# Altium schematic sheet Face_MainBack1V0.SchDoc
size OrCAD D
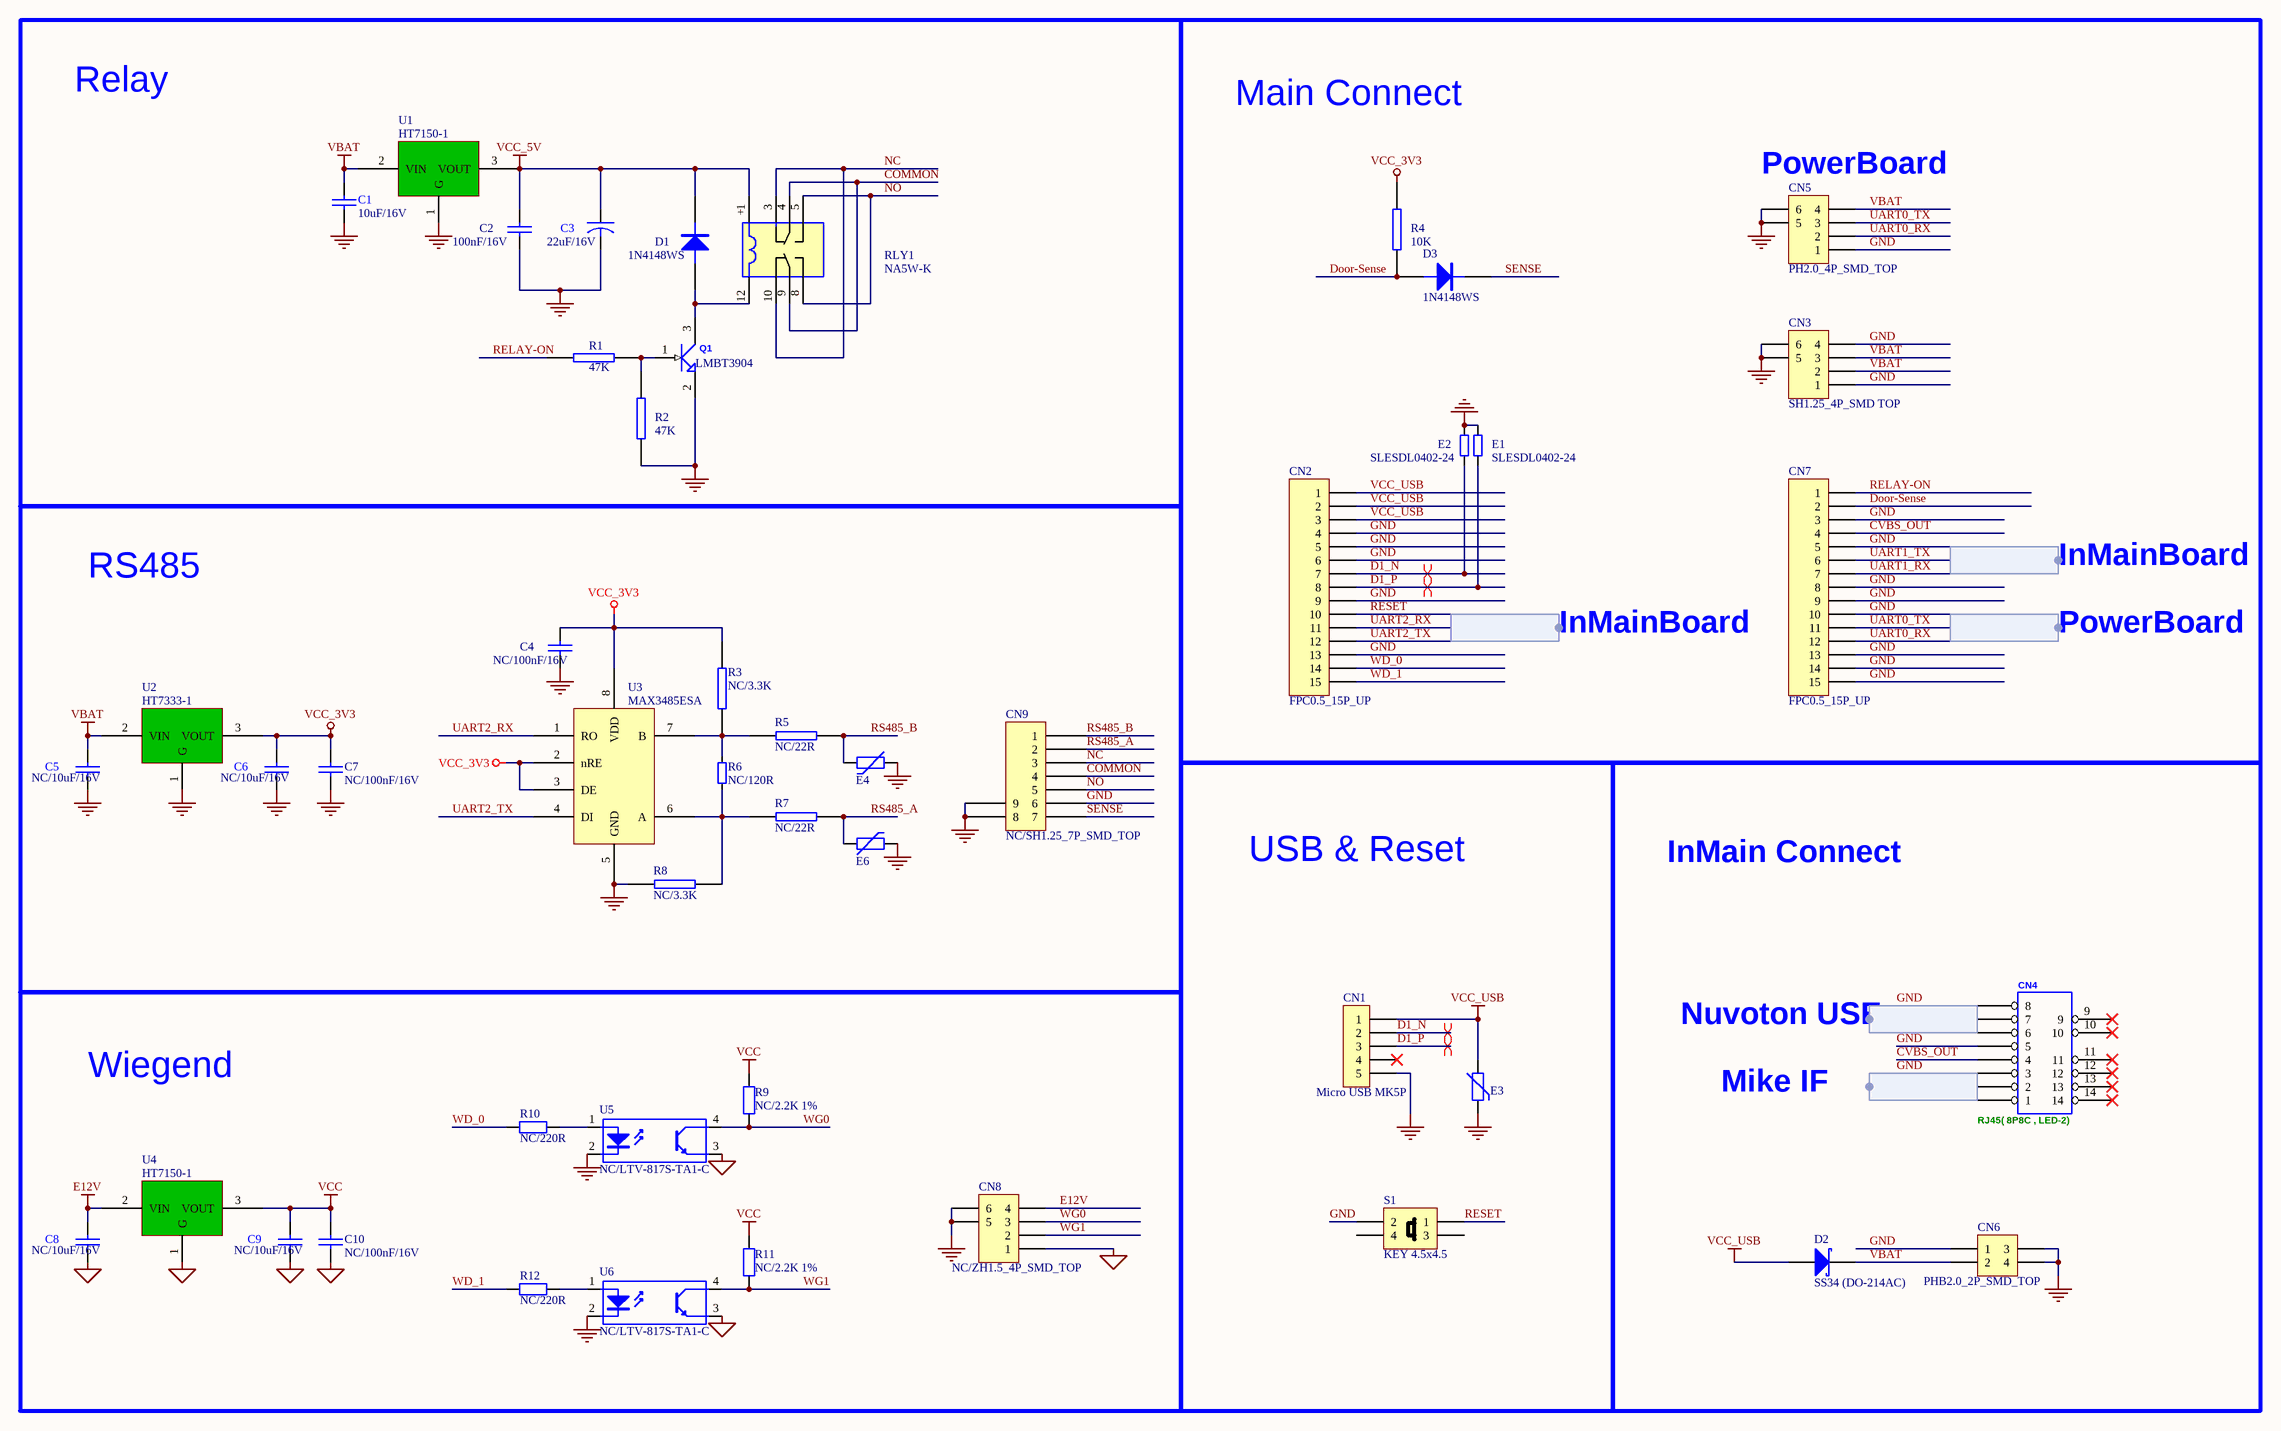
[diagram p0: Face_MainBack1V0.SchDoc]

## Parts
C1  10uF/16V  [C0805]
C2  100nF/16V  [C0402]
C3  22uF/16V  [C0805]
C4  NC/100nF/16V  [C0402]
C5  NC/10uF/16V  [C0805]
C6  NC/10uF/16V  [C0805]
C7  NC/100nF/16V  [C0402]
C8  NC/10uF/16V  [C0805]
C9  NC/10uF/16V  [C0805]
C10  NC/100nF/16V  [C0402]
CN1  micro USB  [MICRO_5P_??]  (value not drawn)
CN2  FPC0.5_15P_UP  [FPC15_0.5_BOTTOM_Drawer]
CN3  SH1.25_4P_SMD TOP  [SH1.25_4P_SMD_TOP]
CN4  RJ45( 8P8C , LED-2)  [RJ45_S]
CN5  PH2.0_4P_SMD_TOP  [PH2.0_4P_SMD_TOP]
CN6  PHB2.0_2P_SMD_TOP  [PH2.0_2P_SMD_TOP]
CN7  FPC0.5_15P_UP  [FPC15_0.5_BOTTOM_Drawer]
CN8  NC/ZH1.5_4P_SMD_TOP  [ZH1.5_4P_SMD_TOP]
CN9  NC/SH1.25_7P_SMD_TOP  [SH1.25_7P_SMD_TOP]
D1  1N4148WS  [SOD-323]
D2  SS34 (DO-214AC)  [DO-214AC]
D3  1N4148WS  [SOD-323]
E1  SLESDL0402-24  [L0402]
E2  SLESDL0402-24  [L0402]
E3  SFI0402-050E330NP-LF  [R0402]  (value not drawn)
E4  NC/SFI0402-050E330NP-LF  [R0402]  (value not drawn)
E6  NC/SFI0402-050E330NP-LF  [R0402]  (value not drawn)
Q1  LMBT3904 (SOT-23-3)  [SOT-23-3]  (value not drawn)
R1  47K  [R0402]
R2  47K  [R0402]
R3  NC/3.3K  [R0402]
R4  10K  [R0402]
R5  NC/22R  [R0402]
R6  NC/120R  [R0402]
R7  NC/22R  [R0402]
R8  NC/3.3K  [R0402]
R9  NC/2.2K 1%  [R0402]
R10  NC/220R  [R0402]
R11  NC/2.2K 1%  [R0402]
R12  NC/220R  [R0402]
RLY1  FUJITSU NA5W-K     DPDT-BM 5V  [NA12W-K]  (value not drawn)
S1  KEY 4.5x4.5  [KEY4.5*4.5-5mm-R]
U1  HT7150-1 (SOT-89)  [SOT-89]  (value not drawn)
U2  NC/HT7333-1 (SOT-89)  [SOT-89]  (value not drawn)
U3  NC/MAX3485ESA(SOIC-8)  [SOIC8]  (value not drawn)
U4  NC/HT7150-1 (SOT-89)  [SOT-89]  (value not drawn)
U5  NC/LTV-817S-TA1-C  [LTV-817S-TA1-C]
U6  NC/LTV-817S-TA1-C  [LTV-817S-TA1-C]

## Blocks framed on the sheet
Relay: C1-C3 D1 Q1 R1 R2 RLY1 U1
Main Connect: CN2 CN3 CN5 CN7 D3 E1 E2 R4
RS485: C4-C7 CN9 E4 E6 R3 R5-R8 U2 U3
USB & Reset: CN1 E3 S1
Wiegend: C8-C10 CN8 R9-R12 U4-U6

## Harnesses
Harness: 

## Nets
E12V: C8.2 CN8.4 U4.2(VIN)
FGND: C8.1 C9.1 C10.1 CN8.1 U4.1(G) U5.3(E) U6.3(E)
GND: C1.2 C2.1 C3.2 C4.1 C5.1 C6.1 C7.1 CN1.5 CN2.4 CN2.5 CN2.6 CN2.9 CN2.13 CN3.1 CN3.4 CN3.5 CN3.6 CN4.3 CN4.5 CN4.8 CN5.1 CN5.5 CN5.6 CN6.1 CN6.3 CN6.4 CN7.3 CN7.5 CN7.8 CN7.9 CN7.10 CN7.13 CN7.14 CN7.15 CN8.5 CN8.6 CN9.6 CN9.8 CN9.9 E1.2 E2.1 E3.2 E4.1 E6.2 Q1.2(E) R2.2 R8.2 S1.2 U1.1(G) U2.1(G) U3.5(GND) U5.2(K) U6.2(K)
VBAT: C1.1 C5.2 CN3.2 CN3.3 CN5.4 CN6.2 D2.2(K) U1.2(VIN) U2.2(VIN)
VCC: C9.2 C10.2 R9.2 R11.2 U4.3(VOUT)
VCC_3V3: C4.2 C6.2 C7.2 R3.1 R4.1 U2.3(VOUT) U3.2(nRE) U3.3(DE) U3.8(VDD)
VCC_5V: C2.2 C3.1 D1.2(K) RLY1.1 U1.3(VOUT)
VCC_USB: CN1.1 CN2.1 CN2.2 CN2.3 D2.1(A) E3.1
COMMON: CN9.4 RLY1.4 RLY1.9
CVBS_OUT: CN4.4 CN7.4
D1_N: CN1.2 CN2.7 E2.2
D1_P: CN1.3 CN2.8 E1.1
Door-Sense: CN7.2 D3.1(A) R4.2
NC: CN9.3 RLY1.3 RLY1.10
NO: CN9.5 RLY1.5 RLY1.8
RELAY-ON: CN7.1 R1.2
RESET: CN2.10 S1.1
RS485_A: CN9.2 E6.1 R7.2
RS485_B: CN9.1 E4.2 R5.2
SENSE: CN9.7 D3.2(K)
UART0_RX: CN5.2 CN7.12
UART0_TX: CN5.3 CN7.11
UART1_RX: CN4.1 CN7.7
UART1_TX: CN4.2 CN7.6
UART2_RX: CN2.11 CN4.7 U3.1(RO)
UART2_TX: CN2.12 CN4.6 U3.4(DI)
WD_0: CN2.14 R10.1
WD_1: CN2.15 R12.1
WG0: CN8.3 R9.1 U5.4(C)
WG1: CN8.2 R11.1 U6.4(C)
NetD1_1: D1.1(A) Q1.3(C) RLY1.12
NetQ1_1: Q1.1(B) R1.1 R2.1
NetR3_2: R3.2 R5.1 R6.1 U3.7(B)
NetR6_2: R6.2 R7.1 R8.1 U3.6(A)
NetR10_2: R10.2 U5.1(A)
NetR12_2: R12.2 U6.1(A)

Not connected (* = marked no-connect by the designer): CN1 4*; CN4 9* 10* 11* 12* 13* 14*; S1 3 4

## Layout directives
differential pair; differential pair class 90ohm; net class 90ohm: D1_N, D1_P

## Notes on the sheet
- (near CN5) PowerBoard
- InMainBoard
- PowerBoard
- InMain Connect
- Nuvoton USE
- Mike IF
- (in symbol CON5) Micro USB MK5P
- (in symbol HT7333) HT7150-1; HT7333-1
- (in symbol MAX485) MAX3485ESA
- (in symbol NPN1) LMBT3904
- (in symbol RELAY4) +; NA5W-K

## Library data of the parts
C1 C5 C6 C8 C9 = CAP: 10uF/16V 10% 0805 X7R ROHS
C2 C4 C7 C10 = CAP: 100nF/16V 10% 0402 X7R ROHS
C3 = CAPACITOR: 22uF/16V 20% 0805 X7R ROHS
CN1 = CON5
CN2 CN7 = Header 15: LatestRevisionDate: 17-Jul-2002; LatestRevisionNote: Re-released for DXP Platform.; Publisher: Altium Limited
CN3 CN5 = Header 4: LatestRevisionDate: 17-Jul-2002; LatestRevisionNote: Re-released for DXP Platform.; Publisher: Altium Limited
CN4 = RJ45
CN6 = Header 2
CN8 = Header 4: ZH1.5_4P_SMD_TOP; LatestRevisionDate: 17-Jul-2002; LatestRevisionNote: Re-released for DXP Platform.; Publisher: Altium Limited
CN9 = Component_1: SH1.25_7P_SMD_TOP
D1 D3 = DIODE
D2 = SS34 (DO-214AC): 物料编号: EEJ00001; 名称: 贴片二极管; 规格，型号: SS34 (DO-214AC)
E1 E2 = RES: SLESDL0402-24 0402 ROHS; 名称: 贴片电阻; Parameter 1: 0R 5% 1/10W 0603 RoHS; Parameter 2: 0R 5% 1/8W 0805 RoHS; Parameter 3: 0.25R 1% 1/4W 1206 ROHS; Parameter 4: 0.25R 1% 1/2W 1812 ROHS; Parameter 5: 0R 1% 1/16W 0402 RoHS
E3 = VARISTOR
E4 E6 = VARISTOR: SFI0402-050E330NP-LF
Q1 = NPN1
R1 R2 = RES2: 47K +/-5% 1/16W 0402 ROHS
R3 R8 = RES2: 3.3K +/-5% 1/16W 0402 ROHS
R4 = RES2: 10K +/-5% 1/16W 0402 ROHS
R5 R7 = RES2: 22R +/-5% 1/16W 0402 ROHS
R6 = Res Semi: 120R +/-5% 1/16W 0402 ROHS; Revision: July-2002: Re-released for DXP Platform.
R9 R11 = Res2: 2.2K +/-1% 1/16W 0402 ROHS; Published: 8-Jun-2000; LatestRevisionDate: 17-Jul-2002; LatestRevisionNote: Re-released for DXP Platform.; PackageReference: AXIAL-0.4; Publisher: Altium Limited; PackageDescription: Axial Device, Thru-Hole; 2 Leads; 0.4 in Pin Spacing
R10 R12 = Res2: 220R +/-5% 1/16W 0402 ROHS; Published: 8-Jun-2000; LatestRevisionDate: 17-Jul-2002; LatestRevisionNote: Re-released for DXP Platform.; PackageReference: AXIAL-0.4; Publisher: Altium Limited; PackageDescription: Axial Device, Thru-Hole; 2 Leads; 0.4 in Pin Spacing
RLY1 = RELAY4
S1 = Header 2X2H: KEY6x6x14; LatestRevisionDate: 17-Jul-2002; LatestRevisionNote: Re-released for DXP Platform.; Publisher: Altium Limited
U1 = HT7333: IC
U2 U4 = HT7333
U3 = MAX485
U5 U6 = Optoisolator1: LTV-817S-TA1-C; Published: 24-Mar-1999; LatestRevisionDate: 04-Mar-2005; LatestRevisionNote: Sch pins 3 & 4 Swapped.; DatasheetVersion: Nov-2003; PackageReference: DIP-4; Publisher: Altium Limited